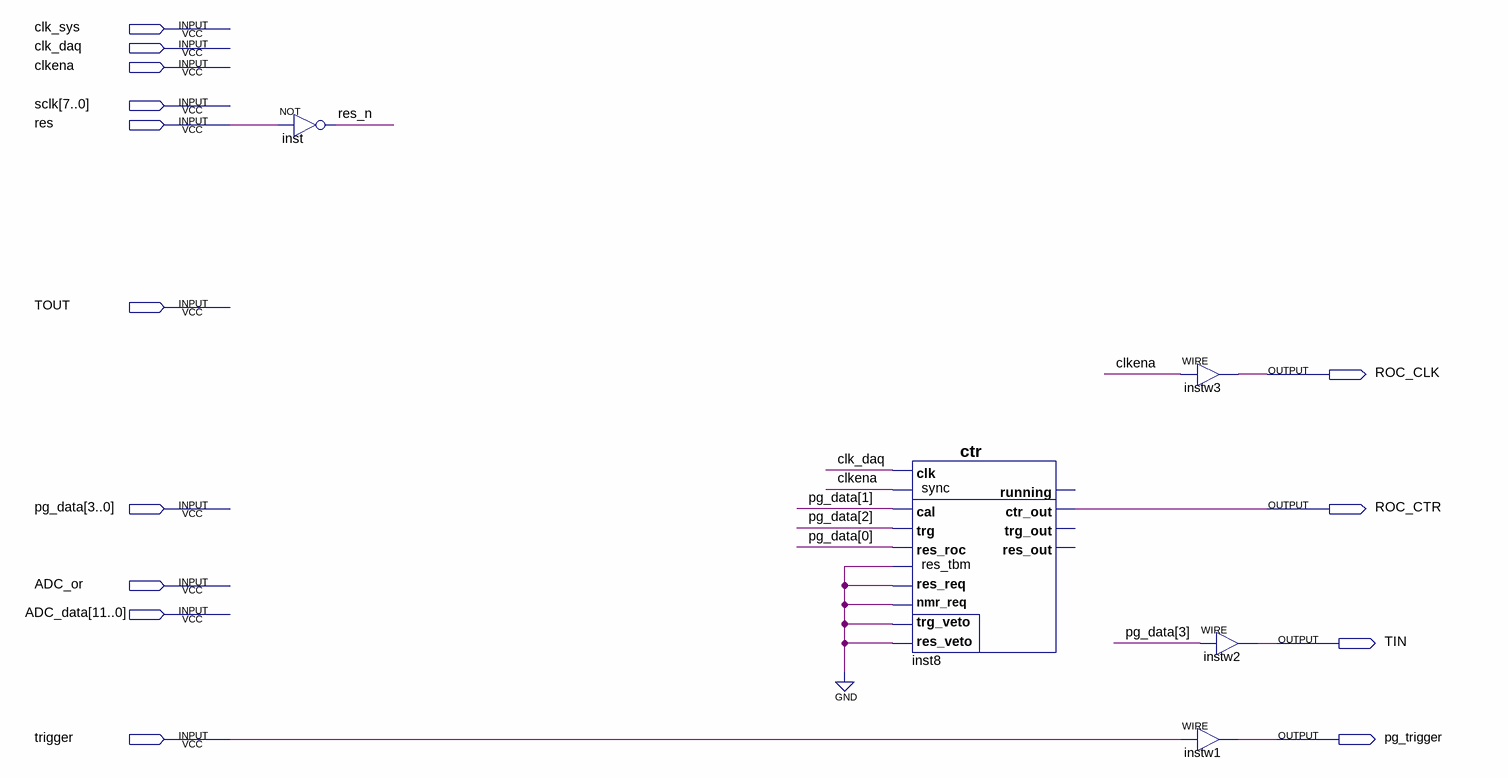
[diagram p0: schematic sheet]
// Quartus schematic FEC.bdf as structural Verilog: 5 symbols, 14 pins
module FEC (
  input  clk_sys,
  input  clk_daq,
  input  clkena,
  input  [7:0] sclk,
  input  res,
  input  TOUT,
  input  [3:0] pg_data,
  input  ADC_or,
  input  [11:0] ADC_data,
  input  trigger,
  output ROC_CLK,
  output ROC_CTR,
  output TIN,
  output pg_trigger
);

  wire res_n;

  not inst (res_n, res);
  ctr inst8 (
    .res_veto(1'b0), .trg_veto(1'b0), .clk(clk_daq), .trg(pg_data[2]), .cal(pg_data[1]), .res_req(1'b0),
    .nmr_req(1'b0), .sync(clkena), .res_tbm(1'b0), .res_roc(pg_data[0]), .ctr_out(ROC_CTR));  // open: running, trg_out, res_out
  assign ROC_CLK = clkena;  // WIRE instw3
  assign TIN = pg_data[3];  // WIRE instw2
  assign pg_trigger = trigger;  // WIRE instw1
endmodule
